# EAGLE schematic snarfbasebasics-v00 (EAGLE 5.11)
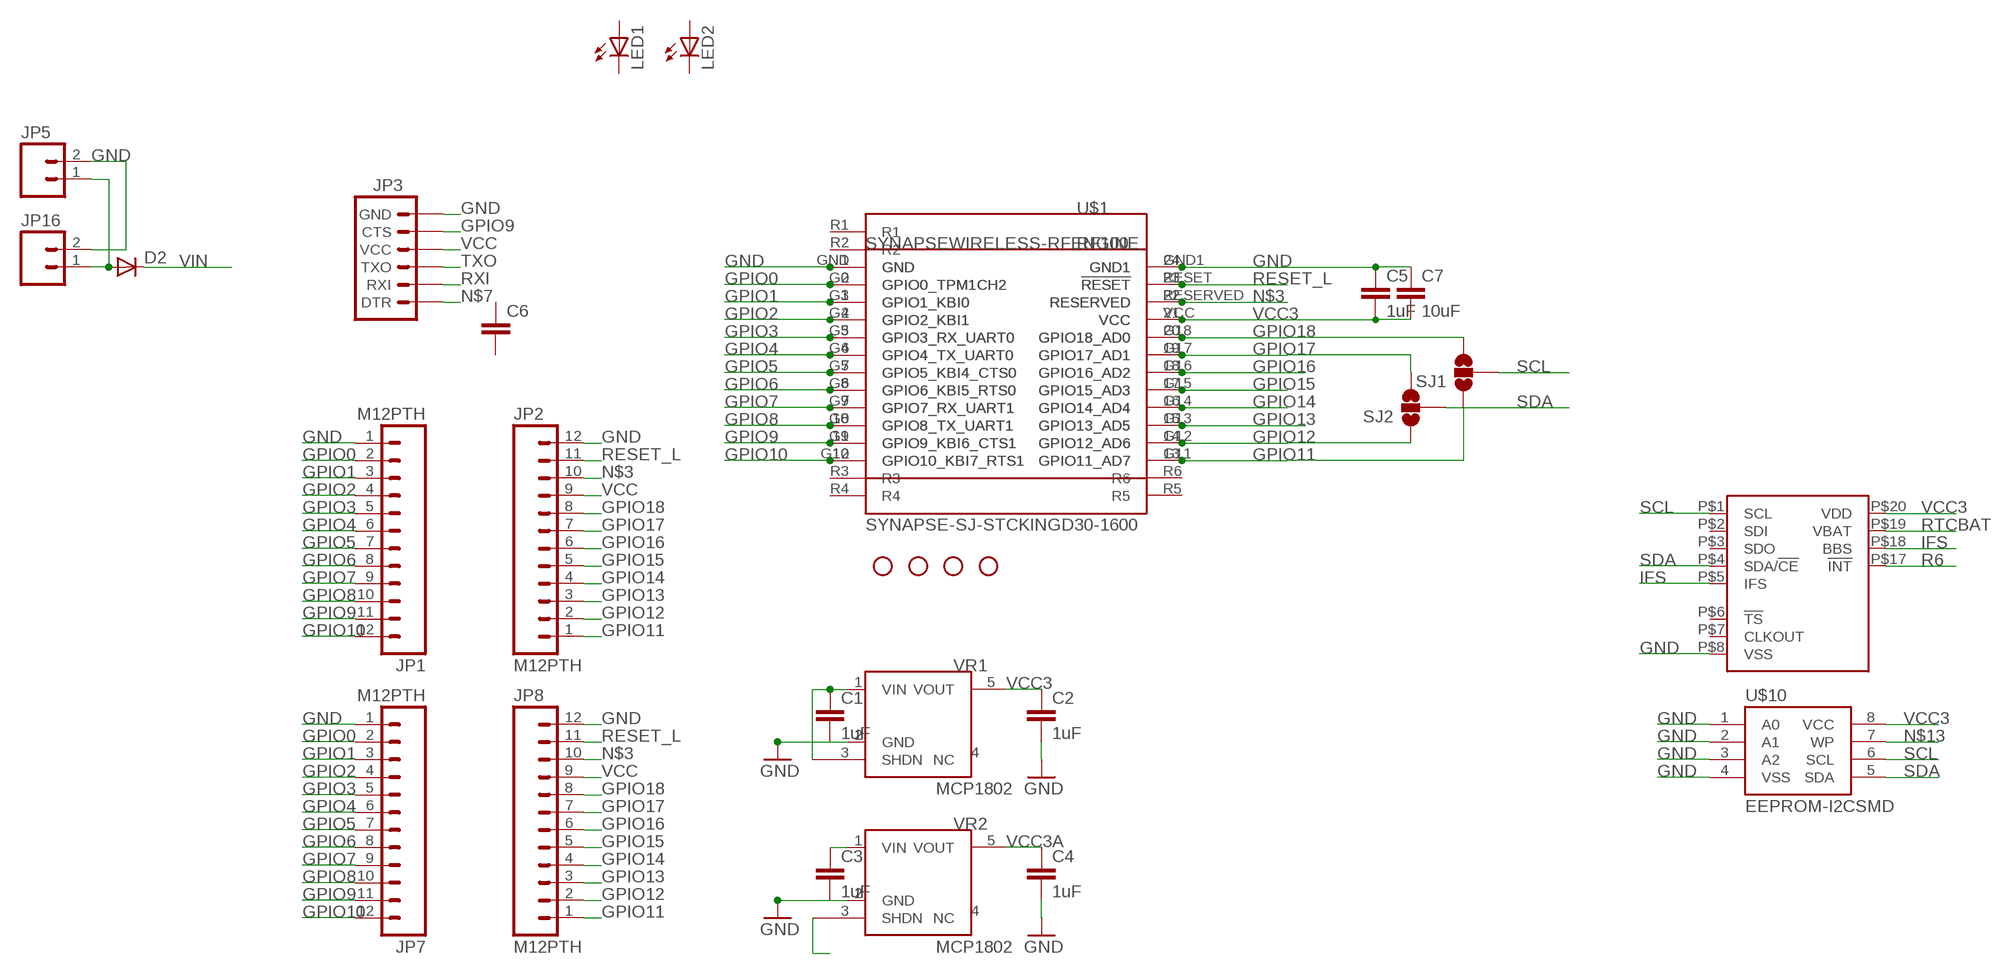
[diagram p0: schematic, sheet 1]

## Parts
C1  1uF  CAP0805  [0805]
C2  1uF  CAP0805  [0805]
C3  1uF  CAP0805  [0805]
C4  1uF  CAP0805  [0805]
C5  1uF  CAP0805  [0805]
C6  CAP0805  [0805]
C7  10uF  CAP0805  [0805]
D2  DIODESMA  [SMA-DIODE]
JP1  M12PTH  [1X12]
JP2  M12PTH  [1X12]
JP3  ARDUINO_SERIAL_PROGRAMPTH  [1X06]
JP5  M02PTH  [1X02]
JP6  STAND-OFF  [STAND-OFF]
JP7  M12PTH  [1X12]
JP8  M12PTH  [1X12]
JP9  STAND-OFF  [STAND-OFF]
JP10  STAND-OFF  [STAND-OFF]
JP11  STAND-OFF  [STAND-OFF]
JP16  M023.5MM  [SCREWTERMINAL-3.5MM-2]
LED1  LED1206  [LED-1206]
LED2  LED1206  [LED-1206]
SJ1  SOLDERJUMPER_2WAYS  [SJ_3]
SJ2  SOLDERJUMPER_2WAYS  [SJ_3]
SYNAPSEWIRELESS-RFENGINE  SYNAPSEWIRELESS-RFENGINESTD  SYNAPSEWIRELESS-RFENGINESTDTHM  [SYNAPSERFENGINE-THM]
U$1  SYNAPSE-SJ-STCKINGD30-1600  [SYNSJ-STACK]
U$4  PCF2129ASO20  [SO20W]
U$10  EEPROM-I2CSMD  [SO08]
VR1  MCP1802  [SOT23-5]
VR2  MCP1802  [SOT23-5]

## Nets
GND: C1.2 C2.2 C3.2 C4.2 C5.1 C7.1 JP1.1 JP2.12 JP3.6(GND) JP5.2 JP7.1 JP8.12 JP16.2 SYNAPSEWIRELESS-RFENGINE.1(GND) SYNAPSEWIRELESS-RFENGINE.24(GND1) U$1.GND U$1.GND1 U$4.P$8(VSS) U$10.1(A0) U$10.2(A1) U$10.3(A2) U$10.4(VSS) VR1.2(GND) VR2.2(GND)
GPIO0: JP1.2 JP7.2 SYNAPSEWIRELESS-RFENGINE.2(GPIO0_TPM1CH2) U$1.G0(GPIO0_TPM1CH2)
GPIO1: JP1.3 JP7.3 SYNAPSEWIRELESS-RFENGINE.3(GPIO1_KBI0) U$1.G1(GPIO1_KBI0)
GPIO2: JP1.4 JP7.4 SYNAPSEWIRELESS-RFENGINE.4(GPIO2_KBI1) U$1.G2(GPIO2_KBI1)
GPIO3: JP1.5 JP7.5 SYNAPSEWIRELESS-RFENGINE.5(GPIO3_RX_UART0) U$1.G3(GPIO3_RX_UART0)
GPIO4: JP1.6 JP7.6 SYNAPSEWIRELESS-RFENGINE.6(GPIO4_TX_UART0) U$1.G4(GPIO4_TX_UART0)
GPIO5: JP1.7 JP7.7 SYNAPSEWIRELESS-RFENGINE.7(GPIO5_KBI4_CTS0) U$1.G5(GPIO5_KBI4_CTS0)
GPIO6: JP1.8 JP7.8 SYNAPSEWIRELESS-RFENGINE.8(GPIO6_KBI5_RTS0) U$1.G6(GPIO6_KBI5_RTS0)
GPIO7: JP1.9 JP7.9 SYNAPSEWIRELESS-RFENGINE.9(GPIO7_RX_UART1) U$1.G7(GPIO7_RX_UART1)
GPIO8: JP1.10 JP7.10 SYNAPSEWIRELESS-RFENGINE.10(GPIO8_TX_UART1) U$1.G8(GPIO8_TX_UART1)
GPIO9: JP1.11 JP3.5(CTS) JP7.11 SYNAPSEWIRELESS-RFENGINE.11(GPIO9_KBI6_CTS1) U$1.G9(GPIO9_KBI6_CTS1)
GPIO10: JP1.12 JP7.12 SYNAPSEWIRELESS-RFENGINE.12(GPIO10_KBI7_RTS1) U$1.G10(GPIO10_KBI7_RTS1)
GPIO11: JP2.1 JP8.1 SJ1.1 SYNAPSEWIRELESS-RFENGINE.13(GPIO11_AD7) U$1.G11(GPIO11_AD7)
GPIO12: JP2.2 JP8.2 SJ2.1 SYNAPSEWIRELESS-RFENGINE.14(GPIO12_AD6) U$1.G12(GPIO12_AD6)
GPIO13: JP2.3 JP8.3 SYNAPSEWIRELESS-RFENGINE.15(GPIO13_AD5) U$1.G13(GPIO13_AD5)
GPIO14: JP2.4 JP8.4 SYNAPSEWIRELESS-RFENGINE.16(GPIO14_AD4) U$1.G14(GPIO14_AD4)
GPIO15: JP2.5 JP8.5 SYNAPSEWIRELESS-RFENGINE.17(GPIO15_AD3) U$1.G15(GPIO15_AD3)
GPIO16: JP2.6 JP8.6 SYNAPSEWIRELESS-RFENGINE.18(GPIO16_AD2) U$1.G16(GPIO16_AD2)
GPIO17: JP2.7 JP8.7 SJ2.3 SYNAPSEWIRELESS-RFENGINE.19(GPIO17_AD1) U$1.G17(GPIO17_AD1)
GPIO18: JP2.8 JP8.8 SJ1.3 SYNAPSEWIRELESS-RFENGINE.20(GPIO18_AD0) U$1.G18(GPIO18_AD0)
IFS: U$4.P$5(IFS) U$4.P$18(BBS)
N$2: D2.A JP5.1 JP16.1
N$3: JP2.10 JP8.10 SYNAPSEWIRELESS-RFENGINE.22(RESERVED) U$1.RESERVED
N$7: JP3.1(DTR)
N$9: VR2.3(SHDN)
N$13: U$10.7(WP)
R6: U$4.P$17(!INT)
RESET_L: JP2.11 JP8.11 SYNAPSEWIRELESS-RFENGINE.23(!RESET) U$1.RESET(!RESET)
RTCBAT: U$4.P$19(VBAT)
RXI: JP3.2(RXI)
SCL: SJ1.2 U$4.P$1(SCL) U$10.6(SCL)
SDA: SJ2.2 U$4.P$4(SDA/!CE) U$10.5(SDA)
TXO: JP3.3(TXO)
VCC: JP2.9 JP3.4(VCC) JP8.9
VCC3: C2.1 C5.2 C7.2 SYNAPSEWIRELESS-RFENGINE.21(VCC) U$1.VCC U$4.P$20(VDD) U$10.8(VCC) VR1.5(VOUT)
VCC3A: C4.1 VR2.5(VOUT)
VIN: C1.1 C3.1 D2.C VR1.1(VIN) VR1.3(SHDN) VR2.1(VIN)
Unconnected: C6.1 C6.2 LED1.A LED1.C LED2.A LED2.C U$1.R1 U$1.R2 U$1.R3 U$1.R4 U$1.R5 U$1.R6 U$4.P$2(SDI) U$4.P$3(SDO) U$4.P$6(!TS) U$4.P$7(CLKOUT) VR1.4(NC) VR2.4(NC)

## Library data of the parts
C1-C7 = 0_jc-custom:CAP: Capacitor Standard 0603 ceramic capacitor, and 0.1" leaded capacitor.
D2 = SparkFun:DIODE: Diode These are standard reverse protection diodes and small signal diodes. SMA package can handle up to about 1A. SOD-323 can handle about 200mA. What the SOD-323 package when ordering, there are some mfgs out there that are 5-pin packages.
JP1 JP2 JP7 JP8 = SparkFun:M12: Header 12 Standard 12-pin 0.1" header. Use with straight break away headers (SKU : PRT-00116), right angle break away headers (PRT-00553), swiss pins (PRT-00743), machine pins (PRT-00117), and female headers (PRT-00115).
JP3 = SparkFun:ARDUINO_SERIAL_PROGRAM
JP5 JP16 = SparkFun:M02: Header 2 Standard 2-pin 0.1" header. Use with straight break away headers (SKU : PRT-00116), right angle break away headers (PRT-00553), swiss pins (PRT-00743), machine pins (PRT-00117), and female headers (PRT-00115). Molex polarized connector foot print use with SKU : PRT-08233 with associated crimp pins and housings.
JP6 JP9-JP11 = SparkFun:STAND-OFF: Stand Off This is the mechanical footprint for a #4 phillips button head screw. Use the keepout ring to avoid running the screw head into surrounding components. SKU : PRT-00447
LED1 LED2 = SparkFun:LED: LEDs Standard schematic elements and footprints for 5mm, 3mm, 1206, and 0603 sized LEDs. 5mm - Spark Fun Electronics SKU : COM-00529 (and others)
SJ1 SJ2 = SparkFun:SOLDERJUMPER_2WAY: Solder Jumper 2 way solder jumper
SYNAPSEWIRELESS-RFENGINE = 0_jc-custom:SYNAPSEWIRELESS-RFENGINE
U$1 = 0_jc-custom:SYNAPSE-SJ-STCKING: Standard layout for expansion modules using Synapse Wireless boards
U$4 = 0_jc-custom:PCF2129A
U$10 = SparkFun:EEPROM-I2C
VR1 VR2 = 0_jc-custom:MCP1802

## Net classes
0 default: width 0.356 mm